# EAGLE design CrabTimerNeoPixel (EAGLE 7.6.0)
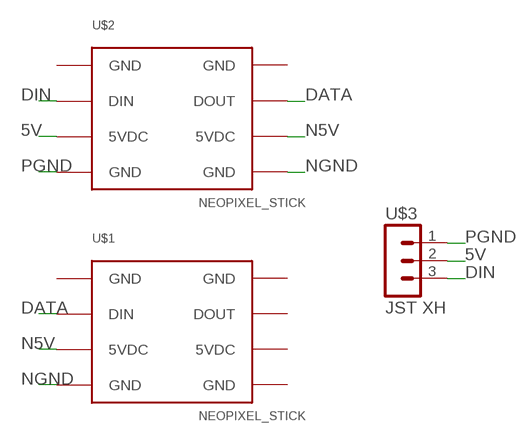
[diagram p0: schematic, sheet 1]

## Parts
U$1  NEOPIXEL_STICK  [NEOPIXEL_STICK_SMD_SHORT/HOLES]
U$2  NEOPIXEL_STICK  [NEOPIXEL_STICK_SMD_SHORT/HOLES]
U$3  JST XH  JST-B3B-XH-A  [B3B-XH-A]

## Nets
5V: U$2.5VDC@1(5VDC) U$3.2
DATA: U$1.DIN U$2.DOUT
DIN: U$2.DIN U$3.3
N5V: U$1.5VDC@1(5VDC) U$2.5VDC@2(5VDC)
NGND: U$1.GND@2(GND) U$2.GND@4(GND)
PGND: U$2.GND@2(GND) U$3.1
Unconnected: U$1.DOUT

## Power pins joined to a net without a drawn wire
5VDC: U$1.5VDC@2(5VDC)
GND: U$1.GND@1(GND) U$1.GND@3(GND) U$1.GND@4(GND) U$2.GND@1(GND) U$2.GND@3(GND)

## Library data of the parts
U$1 U$2 = mylibrary:NEOPIXEL_STICK
U$3 = mylibrary:JST-B3B-XH-A: JST Connector (2.5 mm / 0.1 in) - 3 Circuit / Top Entry

## Board
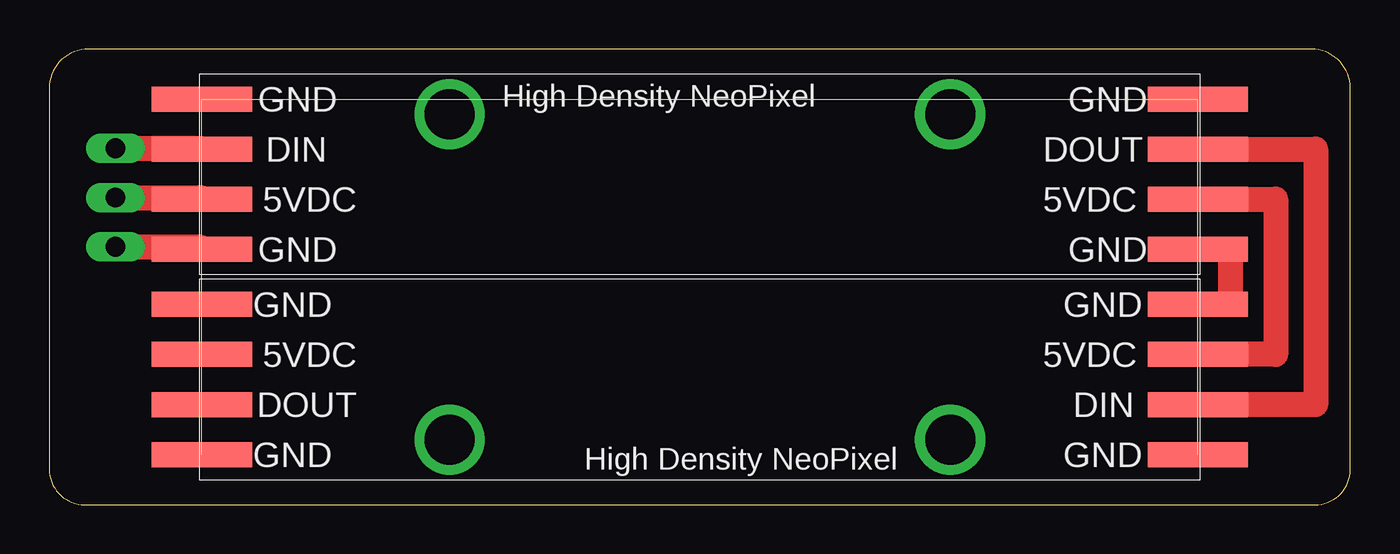
[diagram p1: board, top side]
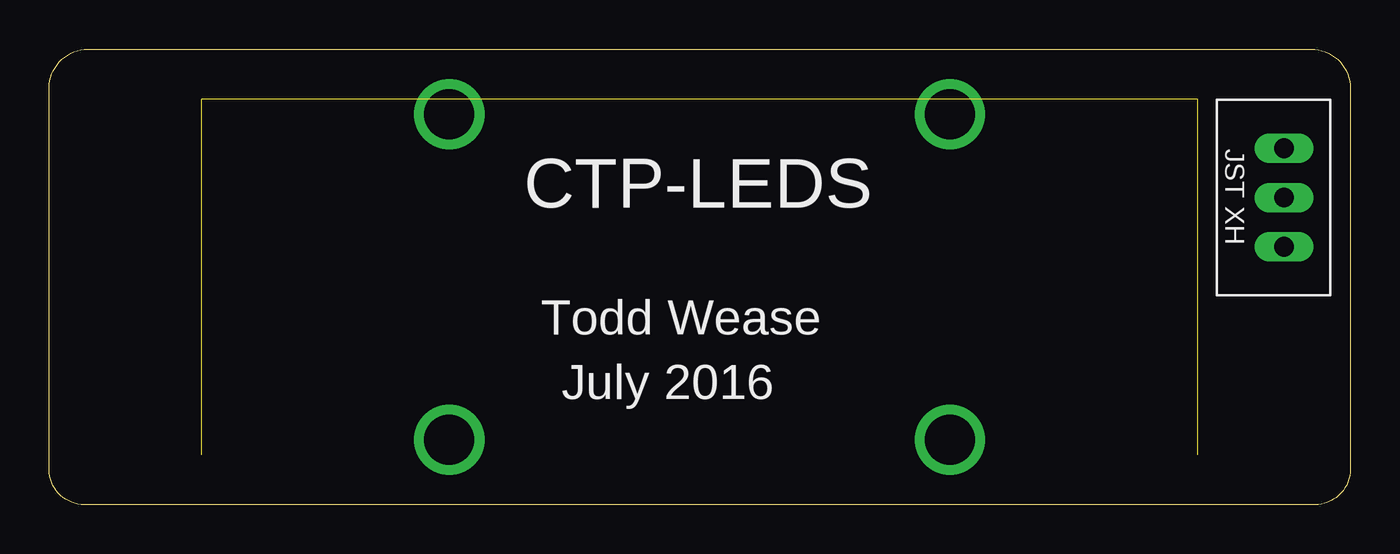
[diagram p2: board, bottom side, seen from below]

Size 66.02 x 23.1 mm. Coordinates in mm from the lower left corner, seen from the top.
Outline: 0,21.13 0,1.8 arc90 1.8,0 64.24,0 arc90 66.02,1.78 66.02,21.14 arc90 64.06,23.1 1.97,23.1 arc90 0,21.13
Copper layers (1*16): Top 0.0356mm / dielectric 1.5011mm / Bottom 0.0356mm
Design rules "oshpark-2layer": minimum track width 6mil, minimum drill 13mil, track to track 6mil, track to pad 6mil, pad to pad 6mil, via to via 6mil, smd to smd 6mil, copper to edge 15mil, drill to drill 6mil, minimum pad ring 7mil, minimum via ring 7mil, stop-mask expansion 2.5mil, vias tented up to drill 0mil, thermal gap 10mil

### Footprints (pad centres in the part's own frame; a part is rotated, then mirrored left to right if it is on the bottom)
NEOPIXEL_STICK_SMD_SHORT/HOLES = smd 5.08 x 1.27: 5VDC@1 -24.765,-1.778; 5VDC@2 25.781,-1.778; DIN -24.765,0.762; DOUT 25.781,0.762; GND@1 -24.765,3.302; GND@2 -24.765,-4.318; GND@3 25.781,3.302; GND@4 25.781,-4.318 | drill 2.54: P$1 -12.192,2.54; P$2 13.208,2.54
B3B-XH-A = drill 1 long: 1 0.95,-1.65; 2 0.95,-4.15; 3 0.95,-6.65

### Placement (x,y rotation side)
U$1  33.53,5.84 180 top
U$2  32.51,17.27 0 top
U$3  2.41,11.43 180 bottom

### Tracks (layer width: path | path; a pad name or v marks a point on that pad's centre or on a via)
5V
  Top 0.406: 7.75,15.62 U$2.5VDC@1 7.75,15.58
  Top 1.27: U$3.2 7.66,15.58 U$2.5VDC@1
DATA
  Top 1.27: U$2.DOUT 64.26,18.03 64.26,5.08 U$1.DIN
DIN
  Top 0.406: 7.75,18.12 U$2.DIN 7.75,18.08
  Top 1.27: U$3.3 7.7,18.08 U$2.DIN
GND  (4 unrouted)
N5V
  Top 1.27: U$2.5VDC@2 62.23,15.49 62.23,7.62 U$1.5VDC@1
NGND
  Top 0.406: U$2.GND@4 59.94,12.95 | 59.94,10.16 U$1.GND@2
  Top 1.27: 59.94,12.95 59.94,10.16
PGND
  Top 0.406: 7.75,13.08 U$2.GND@2
  Top 1.27: U$3.1 7.62,13.08 U$2.GND@2

### Text on the board
bNames: CTP-LEDS | Todd Wease | July 2016